# EAGLE design strobe (EAGLE 6.3)
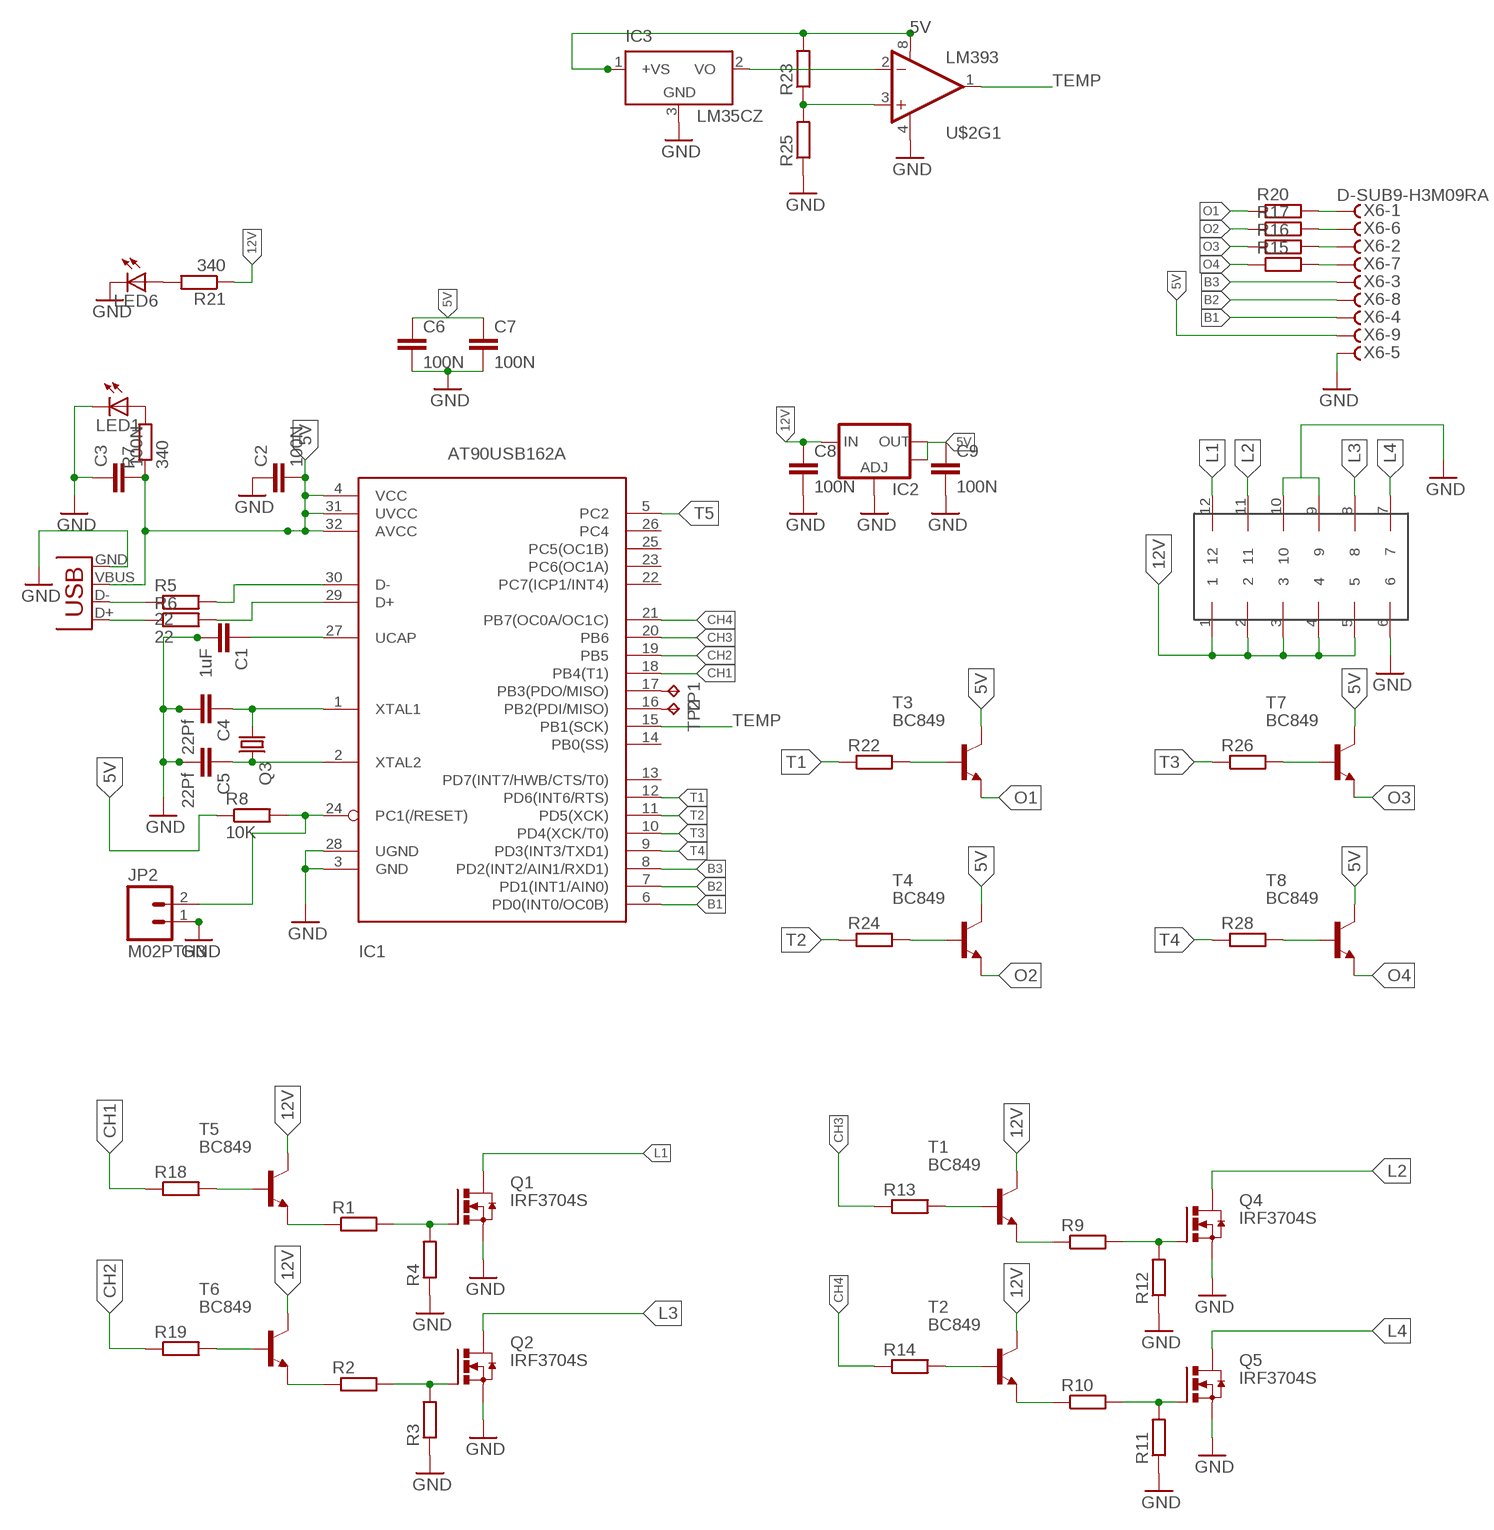
[diagram p0: schematic, sheet 1]

## Parts
C1  1uF  C-EUC0805  [C0805]
C2  100N  C-EUC0805  [C0805]
C3  100N  C-EUC0805  [C0805]
C4  22Pf  C-EUC0603  [C0603]
C5  22Pf  C-EUC0603  [C0603]
C6  100N  C-EUC0805  [C0805]
C7  100N  C-EUC0805  [C0805]
C8  100N  C-EUC0805  [C0805]
C9  100N  C-EUC0805  [C0805]
IC1  AT90USB162A  [TQFP32-08]
IC2  V_REG_LM1117SOT223  [SOT223]
IC3  LM35CZ  [TO92]
JP1  USB-B  USBPTH  [USB-B-PTH]
JP2  M02PTH3  [1X02_LONGPADS]
LED1  LEDSML0805  [SML0805]
LED6  LEDSML0805  [SML0805]
Q1  IRF3704S  [D2PACK]
Q2  IRF3704S  [D2PACK]
Q3  CRYSTALSM49  [SM49]
Q4  IRF3704S  [D2PACK]
Q5  IRF3704S  [D2PACK]
R1  R-EU_R0805  [R0805]
R2  R-EU_R0805  [R0805]
R3  R-EU_R0805  [R0805]
R4  R-EU_R0805  [R0805]
R5  22  R-EU_R0805  [R0805]
R6  22  R-EU_R0805  [R0805]
R7  340  R-EU_R0805  [R0805]
R8  10K  R-EU_R0805  [R0805]
R9  R-EU_R0805  [R0805]
R10  R-EU_R0805  [R0805]
R11  R-EU_R0805  [R0805]
R12  R-EU_R0805  [R0805]
R13  R-EU_R0805  [R0805]
R14  R-EU_R0805  [R0805]
R15  R-EU_R0805  [R0805]
R16  R-EU_R0805  [R0805]
R17  R-EU_R0805  [R0805]
R18  R-EU_R0805  [R0805]
R19  R-EU_R0805  [R0805]
R20  R-EU_R0805  [R0805]
R21  340  R-EU_R0805  [R0805]
R22  R-EU_R0805  [R0805]
R23  R-EU_M0805  [M0805]
R24  R-EU_R0805  [R0805]
R25  R-EU_M0805  [M0805]
R26  R-EU_R0805  [R0805]
R28  R-EU_R0805  [R0805]
T1  BC849  [SOT23]
T2  BC849  [SOT23]
T3  BC849  [SOT23]
T4  BC849  [SOT23]
T5  BC849  [SOT23]
T6  BC849  [SOT23]
T7  BC849  [SOT23]
T8  BC849  [SOT23]
TP1  TPB1,27  [B1,27]
TP2  TPB1,27  [B1,27]
U$1  MF42-10  [MF42-10]
U$2  LM393  [SO08]
X6  D-SUB9-H3M09RA  [H3M09RA]

## Nets
5V: C2.2 C3.2 C6.1 C7.1 C9.1 IC1.4(VCC) IC1.31(UVCC) IC1.32(AVCC) IC2.2(OUT) IC2.4(OUT) IC3.1(+VS) JP1.VBUS R7.1 R8.1 R23.2 T3.3(C) T4.3(C) T7.3(C) T8.3(C) U$2.8(V+) X6.9
12V: C8.1 IC2.3(IN) R21.1 T1.3(C) T2.3(C) T5.3(C) T6.3(C) U$1.1 U$1.2 U$1.3 U$1.4 U$1.5
B1: IC1.6(PD0(INT0/OC0B)) X6.4
B2: IC1.7(PD1(INT1/AIN0)) X6.8
B3: IC1.8(PD2(INT2/AIN1/RXD1)) X6.3
CH1: IC1.18(PB4(T1)) R18.1
CH2: IC1.19(PB5) R19.1
CH3: IC1.20(PB6) R13.1
CH4: IC1.21(PB7(OC0A/OC1C)) R14.1
GND: C1.2 C2.1 C3.1 C4.2 C5.2 C6.2 C7.2 C8.2 C9.2 IC1.3(GND) IC1.28(UGND) IC2.1(ADJ) IC3.3(GND) JP1.GND JP2.1 LED1.C LED6.C Q1.3(S) Q2.3(S) Q4.3(S) Q5.3(S) R3.1 R4.1 R11.1 R12.1 R25.1 U$1.6 U$1.9 U$1.10 U$2.4(V-) X6.5
L1: Q1.2(D) U$1.12
L2: Q4.2(D) U$1.11
L3: Q2.2(D) U$1.8
L4: Q5.2(D) U$1.7
N$1: Q1.1(G) R1.2 R4.2
N$2: Q2.1(G) R2.2 R3.2
N$3: IC3.2(VO) U$2.2(-IN)
N$4: R23.1 R25.2 U$2.3(+IN)
N$5: C1.1 IC1.27(UCAP)
N$6: JP1.D+ R6.1
N$7: JP1.D- R5.1
N$8: IC1.30(D-) R5.2
N$9: IC1.29(D+) R6.2
N$10: LED1.A R7.2
N$11: Q4.1(G) R9.2 R12.2
N$12: C5.1 IC1.2(XTAL2) Q3.2
N$13: C4.1 IC1.1(XTAL1) Q3.1
N$14: IC1.24(PC1(/RESET)) JP2.2 R8.2
N$15: Q5.1(G) R10.2 R11.2
N$18: R9.1 T1.2(E)
N$19: R10.1 T2.2(E)
N$20: R13.2 T1.1(B)
N$21: R14.2 T2.1(B)
N$22: IC1.17(PB3(PDO/MISO)) TP1.TP
N$23: LED6.A R21.2
N$24: R22.2 T3.1(B)
N$25: IC1.16(PB2(PDI/MISO)) TP2.TP
N$26: R20.2 X6.1
N$27: R24.2 T4.1(B)
N$28: R1.1 T5.2(E)
N$29: R2.1 T6.2(E)
N$30: R18.2 T5.1(B)
N$31: R19.2 T6.1(B)
N$33: R17.2 X6.6
N$34: R26.2 T7.1(B)
N$35: R16.2 X6.2
N$36: R15.2 X6.7
N$37: R28.2 T8.1(B)
O1: R20.1 T3.2(E)
O2: R17.1 T4.2(E)
O3: R16.1 T7.2(E)
O4: R15.1 T8.2(E)
T1: IC1.12(PD6(INT6/RTS)) R22.1
T2: IC1.11(PD5(XCK)) R24.1
T3: IC1.10(PD4(XCK/T0)) R26.1
T4: IC1.9(PD3(INT3/TXD1)) R28.1
T5: IC1.5(PC2)
TEMP: IC1.15(PB1(SCK)) U$2.1(OUT)
Unconnected: IC1.13(PD7(INT7/HWB/CTS/T0)) IC1.14(PB0(SS)) IC1.22(PC7(ICP1/INT4)) IC1.23(PC6(OC1A)) IC1.25(PC5(OC1B)) IC1.26(PC4) U$2.5(+IN) U$2.6(-IN) U$2.7(OUT)

## Library data of the parts
C1-C9 = rcl:C-EU: CAPACITOR, European symbol
IC1 = adafruit:AT90USB162: MICROCONTROLLER 8 Kbytes FLASH 1 kbytes SRAM 512 bytes EEPROM USART 6-channel 10 bit ADC 2-channel 8 bit ADC
IC2 = SparkFun-PowerIC:V_REG_LM1117: Voltage Regulator LM1117 Standard adjustable voltage regulator but in SMD form. Spark Fun Electronics SKU : COM-00595
IC3 = lm35:LM35: Single-Supply Centigrade Temperature Sensor Vout = (10mV/°C x Temp °C) +5mmmV Source: http://www.national.com/ds/LM/LM35.pdf
JP1 = SparkFun-Connectors:USB: USB Connectors USB-B-PTH is fully proven SKU : PRT-00139/CONN-08278 USB-miniB is fully proven SKU : PRT-00587 USB-A-PCB is untested. USB-A-H is throughly reviewed, but untested. Spark Fun Electronics SKU : PRT-00437 USB-B-SMT is throughly reviewed, but untested. Needs silkscreen touching up. USB-A-S has not been used/tested USB-MB-H has not been used/tested USB-MICROB has been used. CONN-09505; PROD_ID: CONN-08278
JP2 = SparkFun-Connectors:M02: Standard 2-pin 0.1" header. Use with - straight break away headers ( PRT-00116) - right angle break away headers (PRT-00553) - swiss pins (PRT-00743) - machine pins (PRT-00117) - female headers (PRT-00115) Molex polarized connector foot print use with: PRT-08233 with associated crimp pins and housings. 2.54_SCREWTERM for use with PRT-10571. 3.5mm Screw Terminal footprints for PRT-08084 5mm Screw Terminal footprints for use with PRT-08433
LED1 LED6 = led:LED: LED OSRAM: - CHIPLED LG R971, LG N971, LY N971, LG Q971, LY Q971, LO R971, LY R971 LH N974, LH R974 LS Q976, LO Q976, LY Q976 LO Q996 - Hyper CHIPLED LW Q18S LB Q993, LB Q99A, LB R99A - SideLED LS A670, LO A670, LY A670, LG A670, LP A670 LB A673, LV A673, LT A673, LW A673 LH A674 LY A675 LS A676, LA A676, LO A676, LY A676, LW A676 LS A679, LY A679, LG A679 - Hyper Micro SIDELED® LS Y876, LA Y876, LO Y876, LY Y876 LT Y87S - SmartLED LW L88C, LW L88S LB L89C, LB L89S, LG L890 LS L89K, LO L89K, LY L89K LS L896, LA L896, LO L896, LY L896 - TOPLED LS T670, LO T670, LY T670, LG T670, LP T670 LSG T670, LSP T670, LSY T670, LOP T670, LYG T670 LG T671, LOG T671, LSG T671 LB T673, LV T673, LT T673, LW T673 LH T674 LS T676, LA T676, LO T676, LY T676, LB T676, LH T676, LSB T676, LW T676 LB T67C, LV T67C, LT T67C, LS T67K, LO T67K, LY T67K, LW E67C LS E67B, LA E67B, LO E67B, LY E67B, LB E67C, LV E67C, LT E67C LW T67C LS T679, LY T679, LG T679 LS T770, LO T770, LY T770, LG T770, LP T770 LB T773, LV T773, LT T773, LW T773 LH T774 LS E675, LA E675, LY E675, LS T675 LS T776, LA T776, LO T776, LY T776, LB T776 LHGB T686 LT T68C, LB T68C - Hyper Mini TOPLED® LB M676 - Mini TOPLED Santana® LG M470 LS M47K, LO M47K, LY M47K Source: http://www.osram.convergy.de LUXEON: - LUMILED® LXK2-PW12-R00, LXK2-PW12-S00, LXK2-PW14-U00, LXK2-PW14-V00 LXK2-PM12-R00, LXK2-PM12-S00, LXK2-PM14-U00 LXK2-PE12-Q00, LXK2-PE12-R00, LXK2-PE12-S00, LXK2-PE14-T00, LXK2-PE14-U00 LXK2-PB12-K00, LXK2-PB12-L00, LXK2-PB12-M00, LXK2-PB14-N00, LXK2-PB14-P00, LXK2-PB14-Q00 LXK2-PR12-L00, LXK2-PR12-M00, LXK2-PR14-Q00, LXK2-PR14-R00 LXK2-PD12-Q00, LXK2-PD12-R00, LXK2-PD12-S00 LXK2-PH12-R00, LXK2-PH12-S00 LXK2-PL12-P00, LXK2-PL12-Q00, LXK2-PL12-R00 Source: www.luxeon.com KINGBRIGHT: KA-3528ASYC Source: www.kingbright.com
Q1 Q2 Q4 Q5 = transistor-power:IRF3704: SMPS MOSFET HEXFET® Power MOSFET Source: http://www.irf.com/product-info/datasheets/data/irf3704.pdf
Q3 = crystal:CRYSTAL: CRYSTAL; OC_FARNELL: unknown; OC_NEWARK: unknown
R1-R26 R28 = rcl:R-EU_: RESISTOR, European symbol
T1-T8 = transistor:BC849: NPN TRANSISTOR
TP1 TP2 = testpad:TP: Test pad
U$1 = con-amphenol:MF42-10
U$2 = SparkFun-AnalogIC:LM393: Low-voltage comparator
X6 = con-thomas-betts:D-SUB9-: D-Subminiatur Connector Source: Electronioc Interconnects European Edition 1998; OC_FARNELL: unknown; OC_NEWARK: unknown

## Board
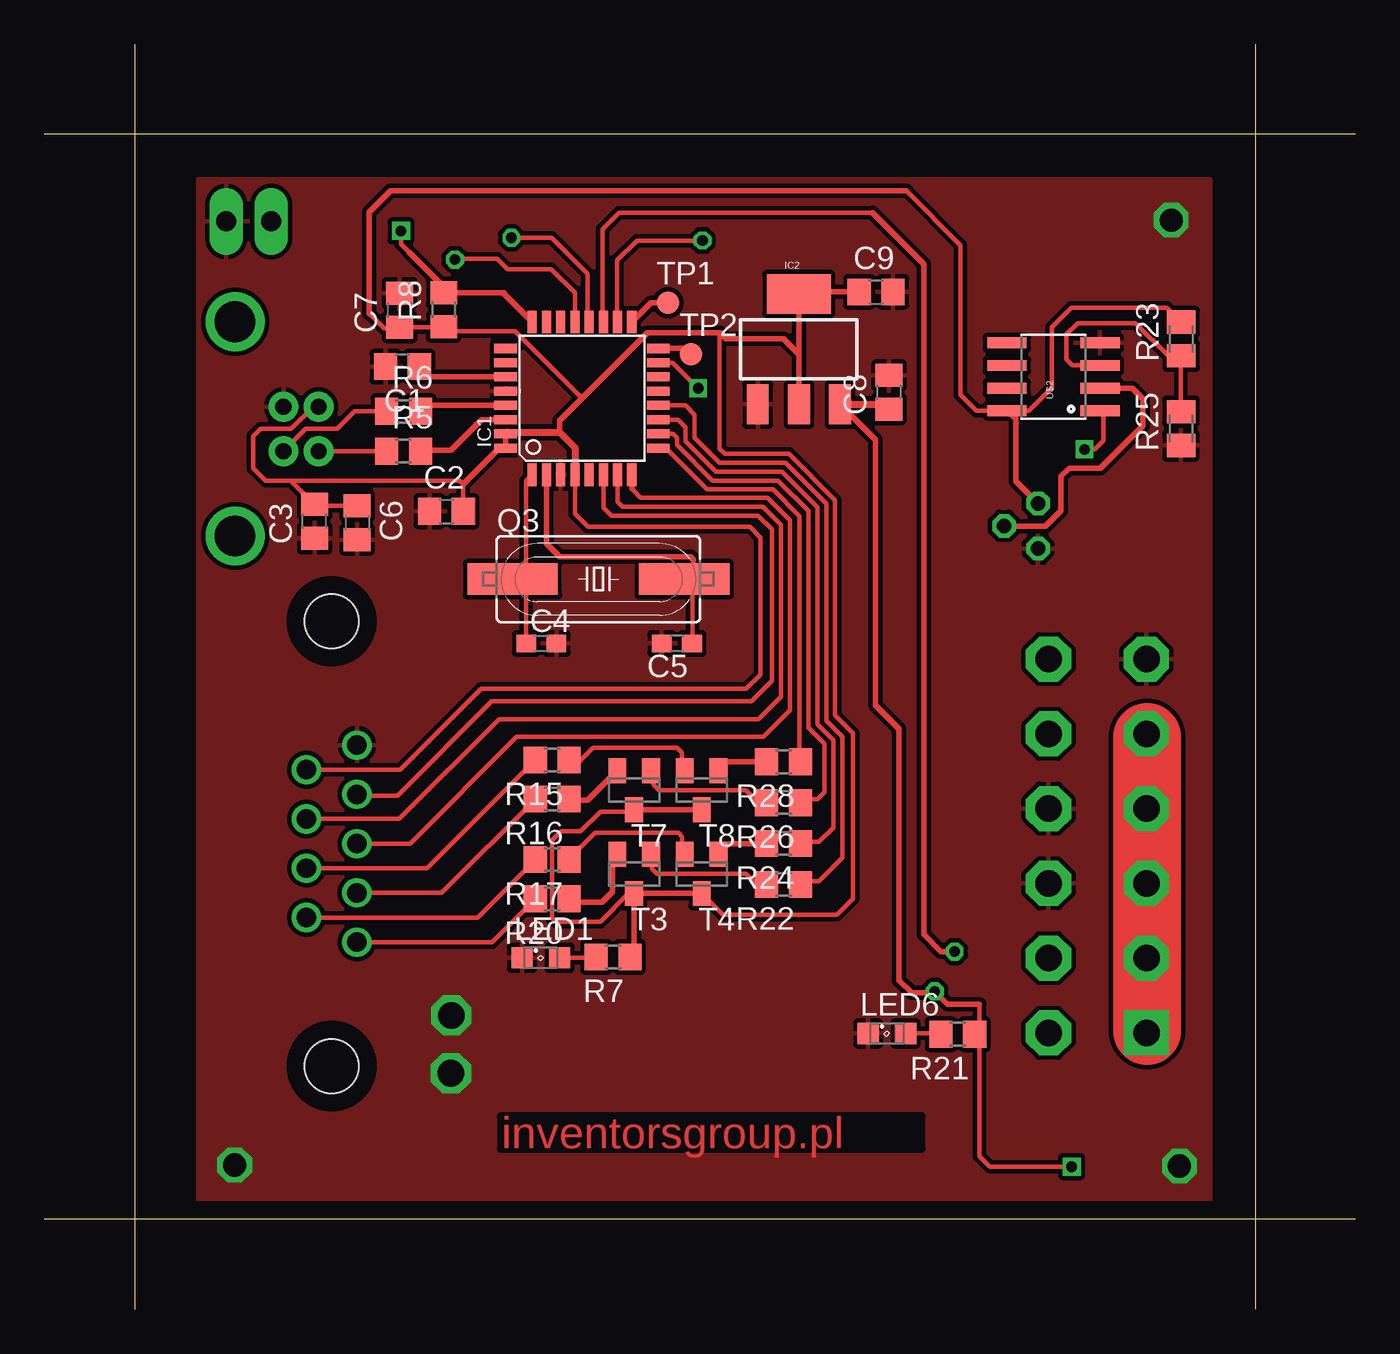
[diagram p1: board, top side]
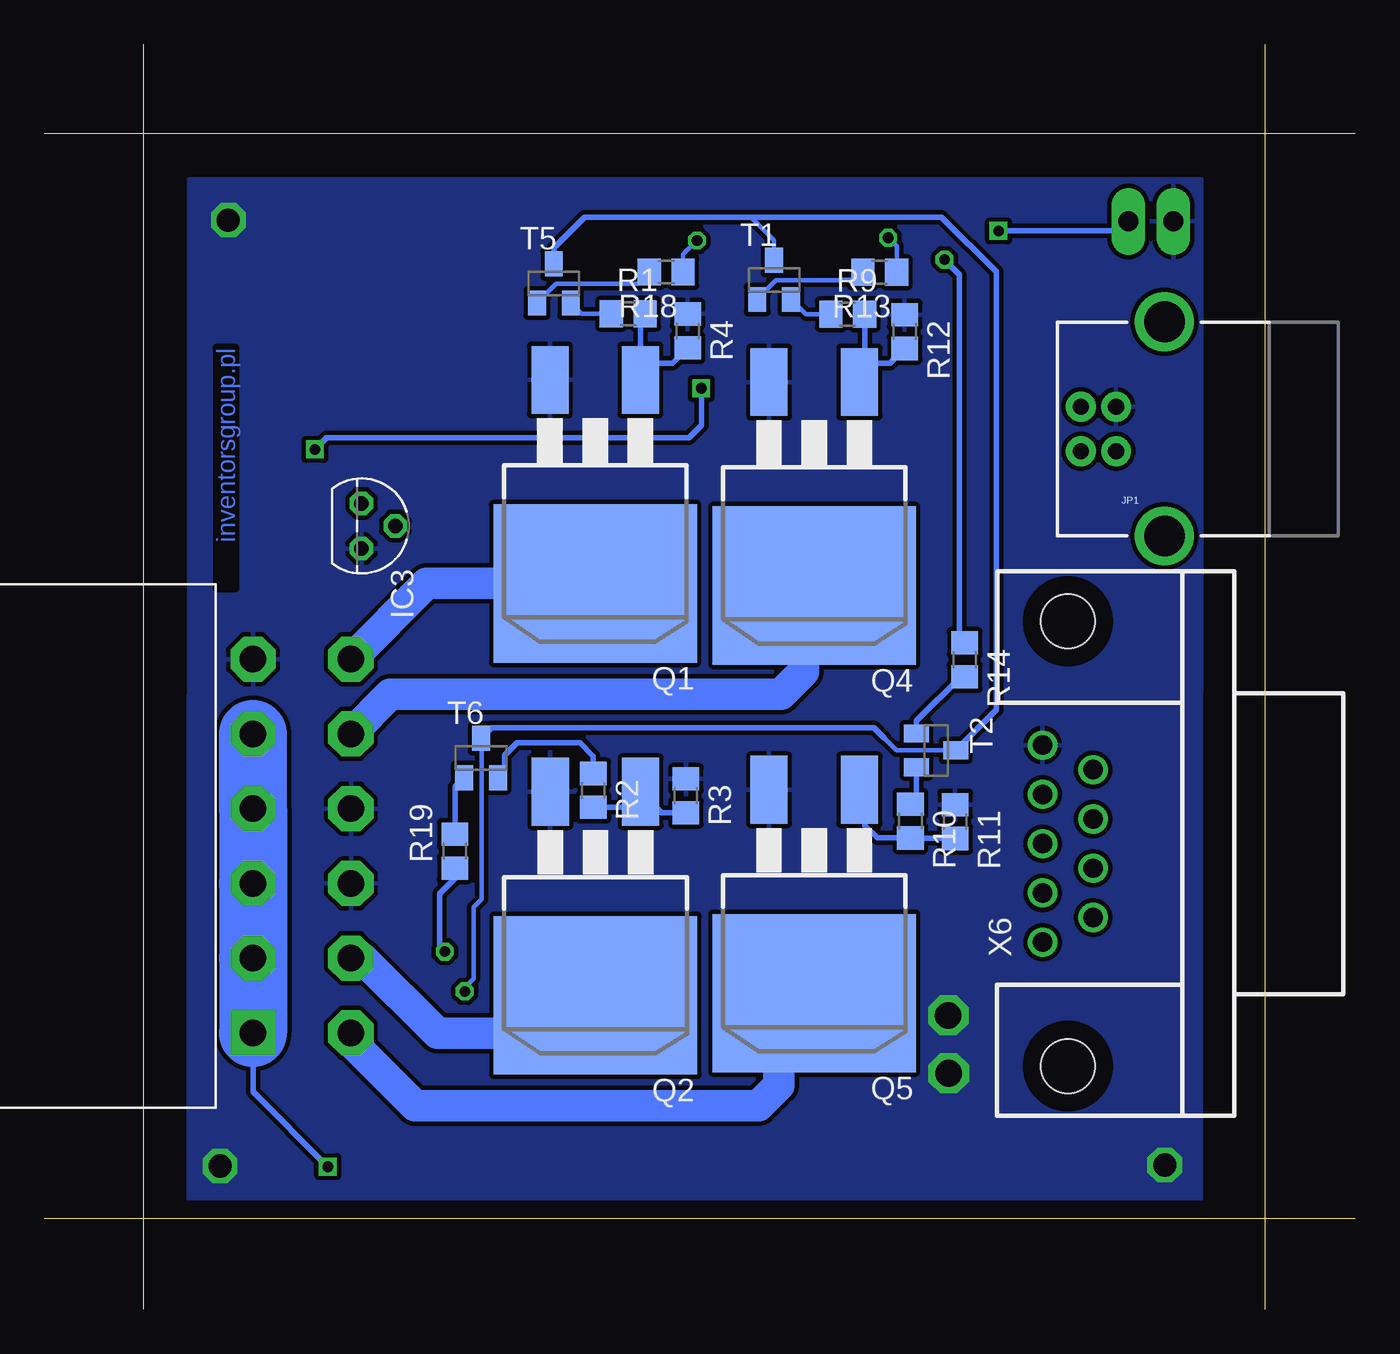
[diagram p2: board, bottom side, seen from below]

Size 73.66 x 71.06 mm. Coordinates in mm from the lower left corner, seen from the top.
Outline: 68.08,0 68.08,71.06
Outline: 5.08,71.06 5.08,0
Outline: 0,5.08 73.66,5.08
Outline: 0,66.04 73.66,66.04
Copper layers (1*16): Top 0.035mm / dielectric 1.5mm / Bottom 0.035mm
Design rules "default": minimum track width 10mil, minimum drill 24mil, track to track 8mil, track to pad 8mil, pad to pad 8mil, via to via 8mil, smd to smd 8mil, copper to edge 40mil, drill to drill 8mil, minimum pad ring 10mil, minimum via ring 8mil, stop-mask expansion 4mil, vias tented up to drill 0mil, thermal gap 10mil

### Footprints (pad centres in the part's own frame; a part is rotated, then mirrored left to right if it is on the bottom)
C0805 = smd 1.3 x 1.5: 1 -0.95,0; 2 0.95,0
C0603 = smd 1.1 x 1: 1 -0.85,0; 2 0.85,0
TQFP32-08 = smd 1.27 x 0.508: 1 -4.293,2.8; 2 -4.293,2; 3 -4.293,1.2; 4 -4.293,0.4; 5 -4.293,-0.4; 6 -4.293,-1.2; 7 -4.293,-2; 8 -4.293,-2.8; 17 4.293,-2.8; 18 4.293,-2; 19 4.293,-1.2; 20 4.293,-0.4; 21 4.293,0.4; 22 4.293,1.2; 23 4.293,2; 24 4.293,2.8 | smd 0.508 x 1.27: 9 -2.8,-4.293; 10 -2,-4.293; 11 -1.2,-4.293; 12 -0.4,-4.293; 13 0.4,-4.293; 14 1.2,-4.293; 15 2,-4.293; 16 2.8,-4.293; 25 2.8,4.293; 26 2,4.293; 27 1.2,4.293; 28 0.4,4.293; 29 -0.4,4.293; 30 -1.2,4.293; 31 -2,4.293; 32 -2.8,4.293
SOT223 = smd 1.219 x 2.235: 1 -2.311,-3.099; 2 0,-3.099; 3 2.311,-3.099 | smd 3.6 x 2.2: 4 0,3.099
TO92 = drill 0.813 octagon: 1 -1.27,0; 2 0,1.905; 3 1.27,0
USB-B-PTH = drill 0.914 pad 1.676: D+ 0,1.25; D- 1.981,1.25; GND 0,-1.25; VBUS 1.981,-1.25 | drill 2.286: S1 -2.718,-6.02; S2 -2.718,6.02
1X02_LONGPADS = drill 1.118 pad 1.88 long: 1 0,0; 2 2.54,0
SML0805 = smd 1.2 x 1.2: A 1.05,0; C -1.05,0
D2PACK = smd 2.083 x 3.81: 1 -2.54,-8.89; 3 2.54,-8.89 | smd 11.43 x 8.89: 2 0,2.54
SM49 = smd 5.08 x 1.778: 1 -4.826,0; 2 4.826,0
R0805 = smd 1.3 x 1.5: 1 -0.95,0; 2 0.95,0
M0805 = smd 1.3 x 1.6: 1 -0.95,0; 2 0.95,0
SOT23 = smd 1 x 1.4: 1 -0.95,-1.1; 2 0.95,-1.1; 3 0,1.1
B1,27 = smd 1.27 x 1.27: TP 0,0
MF42-10 = drill 1.5 pad 2.54 square: 1 16.8,0 | drill 1.5 pad 2.54 octagon: 2 12.6,0; 3 8.4,0; 4 4.2,0; 5 0,0; 6 -4.2,0; 7 16.8,5.5; 8 12.6,5.5; 9 8.4,5.5; 10 4.2,5.5; 11 0,5.5; 12 -4.2,5.5
SO08 = smd 0.61 x 2.21: 1 -1.905,-2.616; 2 -0.635,-2.616; 3 0.635,-2.616; 4 1.905,-2.616; 5 1.905,2.616; 6 0.635,2.616; 7 -0.635,2.616; 8 -1.905,2.616
H3M09RA = drill 1.092: 1 -5.537,1.422; 2 -2.769,1.422; 3 0,1.422; 4 2.769,1.422; 5 5.537,1.422; 6 -4.153,-1.422; 7 -1.384,-1.422; 8 1.384,-1.422; 9 4.153,-1.422 | hole 3.048: -12.497,0; 12.497,0

### Placement (x,y rotation side)
C1  20.12,52.96 180 top
C2  22.59,44.83 0 top
C3  15.18,44.27 90 top
C4  27.92,37.41 0 top
C5  35.54,37.41 180 top
C6  17.58,44.19 270 top
C7  19.96,56.13 90 top
C8  47.46,51.52 90 top
C9  46.74,57.16 0 top
IC1  30.21,51.18 90 top
IC2  42.4,53.94 0 top
IC3  55.84,44.01 270 bottom
JP1  13.43,49.46 180 bottom
JP2  10.21,61.12 0 top
LED1  27.9,19.75 0 top
LED6  47.35,15.49 0 top
Q1  42.71,43.32 180 bottom
Q2  42.69,20.19 180 bottom
Q3  31.13,41.02 0 top
Q4  30.4,43.21 180 bottom
Q5  30.4,20.3 180 bottom
R1  40.85,55.93 0 bottom
R2  42.82,29.15 270 bottom
R3  37.61,28.85 270 bottom
R4  37.51,54.97 270 bottom
R5  20.18,48.21 0 top
R6  20.18,50.45 0 top
R7  31.96,19.8 180 top
R8  22.44,56.16 90 top
R9  28.51,55.9 0 bottom
R10  24.99,27.43 270 bottom
R11  22.48,27.4 270 bottom
R12  25.31,54.93 270 bottom
R13  26.71,58.26 180 bottom
R14  21.94,36.49 270 bottom
R15  28.54,30.86 180 top
R16  28.54,28.66 180 top
R17  28.54,25.26 180 top
R18  38.72,58.27 180 bottom
R19  50.59,25.74 90 bottom
R20  28.54,23.06 180 top
R21  51.33,15.45 180 top
R22  41.54,23.86 180 top
R23  63.9,54.52 90 top
R24  41.54,26.16 180 top
R25  63.88,49.48 90 top
R26  41.54,28.46 180 top
R28  41.54,30.76 180 top
T1  32.65,57.83 0 bottom
T2  23.54,31.4 270 bottom
T3  33.14,24.46 180 top
T4  36.94,24.46 180 top
T5  45.03,57.63 0 bottom
T6  49.12,30.97 0 bottom
T7  33.14,29.16 180 top
T8  36.94,29.16 180 top
TP1  35.04,56.56 0 top
TP2  36.34,53.66 0 top
U$1  61.94,32.33 270 bottom
U$2  56.71,52.39 90 top
X6  16.14,26.16 90 bottom

### Tracks (layer width: path | path; a pad name or v marks a point on that pad's centre or on a via)
5V
  Top 0.254: T7.3 33.04,27.96 31.24,27.96 30.14,26.86 29.04,26.86 28.64,26.46 | T3.3 32.84,23.36 31.24,21.76 28.74,21.76 28.54,21.96 28.54,26.36 28.64,26.46 | T4.3 38.14,22.16 44.54,22.16 45.44,23.06 45.44,32.36 44.44,33.36 44.44,45.46 41.84,48.06 38.24,48.06 37.94,48.36 37.94,54.85 | 13.84,46.56 12.44,46.56 11.74,47.26 11.74,49.06 12.14,49.46 13.87,49.46 15.12,50.71 JP1.VBUS | 13.84,46.56 23.34,46.56 23.54,46.36 C2.2 | 13.84,46.56 C3.2 15.26,45.14 C6.1 | 30.31,51.29 30.11,51.29 26.44,54.96 22.69,54.96 R8.1 22.54,55.16 C7.1 19.89,55.11 19.09,55.11 18.3,55.9 | IC1.4 29.81,44.69 30.54,43.96 39.64,43.96 40.24,43.36 40.24,35.66 39.44,34.86 24.54,34.86 19.99,30.31 X6.9 | 28.64,26.46 | 54.64,50.49 U$2.8 52.39,50.49 51.49,51.38 51.49,59.79 48.44,62.84 | 54.64,50.49 55.33,50.49 56.62,51.78 56.62,55.17 57.72,56.27 63.09,56.27 R23.2 | 41.73,57.71 IC2.4 | 54.5,50.35 54.64,50.49
  Top 0.305: 26.01,49.28 IC1.31 IC1.32 25.56,48.38 23.54,46.36 | 37.96,54.86 38.3,54.52 41.53,54.52 42.4,53.65 | 37.96,54.86 33.89,54.86 30.31,51.29 28.94,49.91 28.94,49.28 | 42.4,53.65 IC2.4 42.52,57.16 C9.1 | 42.4,51.69 IC2.2 42.4,53.65 | T7.3 T8.3 | T3.3 | T3.3 T4.3 | 37.94,54.85 arc-90 37.96,54.86 | R7.1 33.14,20.03 T3.3 | 48.44,62.84 19.46,62.84 18.25,61.63 18.25,55.95 18.3,55.9 | U$2.8 54.16,50.49 54.61,50.04 54.61,46.51 IC3.1
  Top 0.406: 26.01,49.28 28.94,49.28 29.81,48.41 IC1.4
12V  (via drill 0.6)
  Top 0.254: 46.71,44.66 46.71,45.72 | R21.1 52.55,15.72 | 52.55,15.72 52.55,17.15 | 52.55,15.72 52.55,8.59 53.13,8.01 v57.73,8.01
  Top 0.305: IC2.3 46.71,48.84 46.71,45.72 46.71,33.93 48.03,32.61 48.03,18.49 48.74,17.78 49.96,17.78 v50.04,17.86 50.75,17.15 52.55,17.15
  Top 0.406: 44.71,49.94 IC2.3 47.19,50.84 C8.1
  Bottom 0.254: T2.3 25.78,31.39 26.46,32.07 | T1.3 32.65,60.06 33.96,61.37 43.31,61.37 | T6.3 49.1,32.05 49.1,23.04 49.55,22.58 49.55,18.57 50.04,18.09 v50.04,17.86
  Bottom 0.305: T5.3 45.03,59.64 43.31,61.37 23.24,61.37 20.17,58.29 20.17,33.67 T2.3 | T6.3 48.52,32.66 27.05,32.66 26.46,32.07 | v57.73,8.01 61.94,12.21 U$1.1
  Bottom 3.81: U$1.5 U$1.4 U$1.3 U$1.2 U$1.1
B1
  Top 0.254: IC1.6 31.41,45.03 31.86,44.58 40.12,44.58 40.88,43.81 40.88,35.31 39.73,34.16 25.14,34.16 19.84,28.86 17.03,28.86 X6.4
  Top 0.305: IC1.6 31.35,46.83
B2
  Top 0.254: IC1.7 32.21,45.37 32.5,45.08 40.37,45.08 41.39,44.07 41.39,34.42 40.13,33.16 25.54,33.16 19.94,27.56 14.13,27.56 X6.8
  Top 0.305: IC1.7 32.12,46.79
B3
  Top 0.254: 33.01,46.09 33.51,45.59 40.62,45.59 41.89,44.32 41.89,33.65 40.4,32.16 26.54,32.16 20.54,26.16 X6.3
  Top 0.305: IC1.8 33.01,46.09
CH1  (via drill 0.6)
  Top 0.254: IC1.18 32.18,55.5 32.18,58.93 33.3,60.05 v36.98,60.05
  Bottom 0.254: v36.98,60.05 37.77,59.26 R18.1
CH2  (via drill 0.6)
  Top 0.254: IC1.19 31.37,55.51 31.37,60.68 32.28,61.6 46.53,61.6
  Top 0.305: 46.53,61.6 49.43,58.7 49.43,21.06 50.39,20.09 v51.16,20.09
  Bottom 0.305: v51.16,20.09 51.46,20.4 51.46,23.34 50.59,24.21 R19.1
CH3  (via drill 0.6)
  Top 0.254: IC1.20 30.53,55.55 30.53,58.17 28.5,60.2 v26.24,60.2
  Bottom 0.254: v26.24,60.2 25.76,59.72 R13.1
CH4  (via drill 0.6)
  Top 0.254: IC1.21 29.82,55.48 29.82,57.1 28.47,58.45 26.04,58.45 25.45,59.03 23.16,59.03 23.04,59.03
  Top 0.305: v23.07,58.97 23.16,58.97 23.16,59.03
  Bottom 0.305: R14.1 22.22,37.73 22.22,58.12 v23.07,58.97
GND  (via drill 1.3, 1.5)
  Top 0.305: IC1.28 25.9,51.56
  other vias: 10.69,8.1 63.79,8.05 63.33,61.19 22.86,16.51 22.84,13.26
  pour Top (isolate 0.254): 8.64,63.5 65.53,63.5 65.53,5.59 8.64,5.59
  pour Bottom (isolate 0.254): 8.64,63.5 65.53,63.5 65.56,5.62 8.67,5.87
L1
  Bottom 1.27: 47.31,40.78 44.45,40.78 Q1.2
  Bottom 1.778: U$1.12 52.18,40.78 44.45,40.78
L2
  Bottom 1.778: U$1.11 54.22,34.54 32.26,34.54 30.99,35.81 30.99,40.13 30.45,40.67 Q4.2
L3
  Bottom 1.778: Q2.2 44.84,15.49 51.56,15.49 55.79,19.73 U$1.8
L4
  Bottom 1.27: Q5.2 32.38,15.77
  Bottom 1.778: 32.38,15.77 32.38,12.57 33.53,11.43 52.83,11.43 56.44,15.04 U$1.7
N$1
  Bottom 0.305: R1.2 40.17,55.66 40.17,53.16 | 40.17,53.16 Q1.1 | R4.2 38.37,53.16 40.17,53.16
N$2
  Bottom 0.305: R2.2 40.15,28.2 Q2.1 38.97,27.9 R3.2
N$3
  Top 0.305: U$2.2 61.15,51.76 61.75,51.16 61.75,49.65 59.36,47.26 57.61,47.26 57.14,46.79 57.14,44.86 56.27,43.99 53.96,43.99 IC3.2
N$4
  Top 0.254: 63.35,53.03 R23.1 | R25.2 63.88,53.55 R23.1 | U$2.3 57.78,53.03 57.44,53.37 57.44,54.78 58.07,55.41 61.32,55.41 63.16,53.57 R23.1
N$5
  Top 0.305: IC1.27 21.17,52.38 C1.1
N$6
  Top 0.254: R6.1 17.43,50.45 16.44,49.46 14.68,49.46 JP1.D+
N$7
  Top 0.254: R5.1 JP1.D- | JP1.D-
N$8
  Top 0.305: IC1.30 24.56,49.98 22.84,48.26 21.18,48.26 R5.2
N$9
  Top 0.305: IC1.29 21.46,50.78 R6.2
N$10
  Top 0.254: LED1.A 31,19.75 R7.2
N$11
  Bottom 0.305: Q4.1 27.56,52.4 27.56,53.16 | 27.56,53.16 R9.2 | R12.2 26.13,53.16 27.56,53.16
N$12
  Top 0.254: 36.42,41.21 36.48,41.24 36.48,42.11 | 36.42,41.21 Q3.2 | C5.1 36.48,37.5 36.42,37.56 36.42,41.21
  Top 0.305: IC1.2 28.21,43.02 28.94,42.29 36.31,42.29 36.48,42.11 | 36.48,40.5 36.49,40.95 Q3.2 36.54,41.04 36.54,41.16 36.39,41.01
N$13
  Top 0.254: 27.41,41.82 Q3.1 27.07,40.55 | IC1.1 27.07,46.55 27.07,41.06 27.07,40.55 | C4.1 27.07,40.55
  Top 0.305: 27.41,41.53 Q3.1 26.97,40.95 | 26.97,37.31 C4.1
N$14  (via drill 0.6)
  Top 0.254: 20.5,59.38 20.04,59.84 v20.04,60.59
  Top 0.305: 27.41,55.76 IC1.24 25.82,57.06 25.82,57.11 R8.2 22.44,57.47 22.41,57.47 20.5,59.38
  Bottom 0.305: v20.04,60.59 13.28,60.59 JP2.2
N$15
  Bottom 0.305: Q5.1 27.54,28.88 27.54,27.16 26.86,26.48 R10.2 24.96,26.45 R11.2
N$16
  Top 3.81: 61.98,15.64 61.98,32.15
N$18
  Bottom 0.254: T1.2 30.87,55.9 R9.1
N$19
  Bottom 0.305: T2.2 24.64,28.73 R10.1
N$20
  Bottom 0.254: T1.1 33.6,56.75 32.54,57.81 28.83,57.81 28.8,57.84 28.09,57.84 R13.2
  Bottom 0.305: R13.2 27.77,58.15
N$21
  Bottom 0.305: T2.1 24.64,33.06 22.16,35.54 R14.2
N$22
  Top 0.305: IC1.17 34.1,56.56 TP1.TP
N$23
  Top 0.254: R21.2 50.34,15.5 LED6.A
N$24
  Top 0.254: T3.1 34.14,25.51 34.14,24.76 34.44,24.46 39.44,24.46 40.04,23.86 R22.2
N$25
  Top 0.305: IC1.16 36.34,53.98 TP2.TP
N$26
  Top 0.254: X6.1 25.15,20.62 R20.2
N$27
  Top 0.254: T4.1 38.49,26.16
  Top 0.305: 38.49,26.16 R24.2
N$28
  Bottom 0.254: T5.2 43.48,55.93 R1.1
N$29
  Bottom 0.305: T6.2 47.87,29.57 47.8,29.64 47.8,31.12 47.09,31.83 43.56,31.83 42.81,31.08 R2.1
N$30
  Bottom 0.254: T5.1 44.91,57.61 40.33,57.61 R18.2
N$31
  Bottom 0.305: T6.1 50.59,29.35 R19.2
N$33
  Top 0.254: R17.2 24.34,22.01 X6.6
N$34
  Top 0.254: T7.1 34.24,30.11 34.24,29.46 34.54,29.16 39.44,29.16 40.14,28.46 R26.2
N$35
  Top 0.254: R16.2 22.32,23.39 X6.2
N$36
  Top 0.254: R15.2 21.51,24.78 X6.7
N$37
  Top 0.254: T8.1 38.39,30.76
  Top 0.305: 38.39,30.76 R28.2
O1
  Top 0.254: T3.2 31.94,25.31
  Top 0.305: 31.94,25.31 31.94,23.46 31.34,22.86 29.69,22.86 R20.1
O2
  Top 0.254: T4.2 35.84,25.71 35.84,26.56 35.64,26.76 30.94,26.76 29.57,25.39 29.57,25.34 R17.1
O3
  Top 0.305: T7.2 30.52,28.59 29.56,28.59 R16.1
O4
  Top 0.254: T8.2 35.84,30.41 35.84,31.26 35.54,31.56 30.84,31.56 30.08,30.8
  Top 0.305: 30.08,30.8 29.55,30.8 R15.1
T1
  Top 0.254: 42.69,24.06 43.54,24.06 44.84,25.36 44.84,32.16 43.94,33.06 43.94,45.26 41.64,47.56 37.94,47.56 36.54,48.96 36.54,50.26 36.02,50.78 IC1.12
  Top 0.305: R22.1 42.69,24.06
T2
  Top 0.254: 42.59,26.26 43.54,26.26 44.34,27.06 44.34,31.96 43.44,32.86 43.44,45.06 41.44,47.06 37.74,47.06 36.04,48.76 36.04,49.56 35.62,49.98 IC1.11
  Top 0.305: R24.1 42.59,26.26
T3
  Top 0.254: 42.69,28.66 43.44,28.66 43.84,29.06 43.84,31.76 42.94,32.66 42.94,44.86 41.24,46.56 37.54,46.56 35.54,48.56 35.54,48.96 35.32,49.18 IC1.10
  Top 0.305: R26.1 42.69,28.66
T4
  Top 0.254: 42.44,30.81 42.44,44.56 40.94,46.06 37.24,46.06 34.92,48.38
  Top 0.305: R28.1 42.44,30.81 | 34.92,48.38 IC1.9
TEMP  (via drill 0.6)
  Top 0.254: IC1.15 35.31,53.18 v36.74,51.74 | v58.46,48.31 59.03,48.31 59.52,48.8 59.52,50.29 U$2.1
  Bottom 0.254: v36.74,51.74 36.74,49.72 | 58.36,48.41 v58.46,48.31
  Bottom 0.305: 58.36,48.41 57.81,48.96 37.44,48.96 36.74,49.66 v36.74,51.74

### Text on the board
Top: inventorsgroup.pl
Bottom: inventorsgroup.pl